# EAGLE design Pro_Micro_ISP (EAGLE 9.6.0)
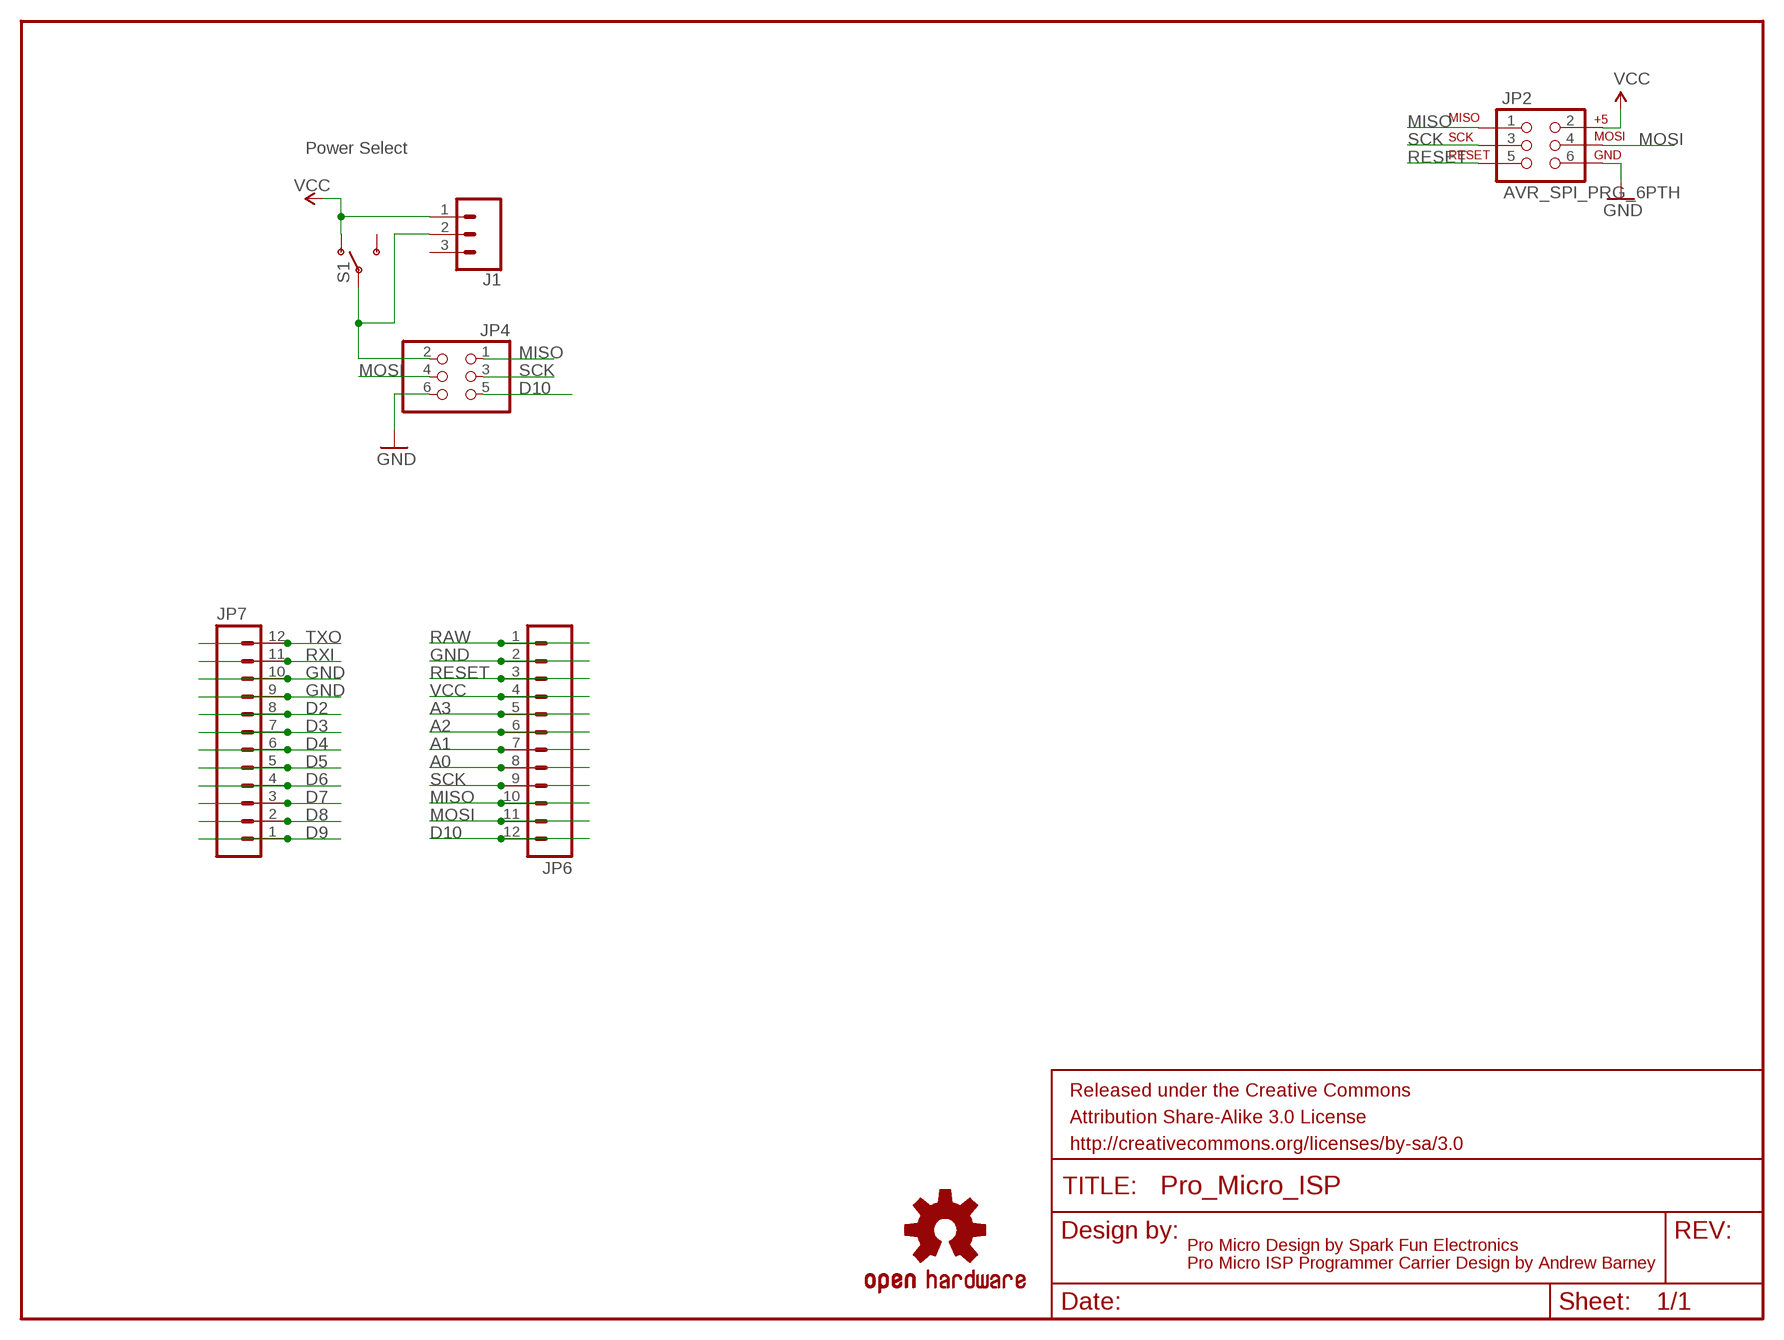
[diagram p0: schematic, sheet 1]

## Parts
FRAME1  FRAME-LETTER  [CREATIVE_COMMONS]
J1  CONN_03  [1X03]
JP2  AVR_SPI_PRG_6PTH  [2X3]
JP4  PINHD-2X3  [2X03]
JP6  M12PTH  [1X12]
JP7  M12PTH  [1X12]
S1  Power Select  SWITCH-SPSTSMD  [AYZ0202]
U$3  OSHW-LOGOS  [OSHW-LOGO-S]

## Nets
A0: JP6.8
A1: JP6.7
A2: JP6.6
A3: JP6.5
D2: JP7.8
D3: JP7.7
D4: JP7.6
D5: JP7.5
D6: JP7.4
D7: JP7.3
D8: JP7.2
D9: JP7.1
D10: JP4.5 JP6.12
GND [vcc]: JP2.6 JP4.6 JP6.2 JP7.9 JP7.10
MISO: JP2.1 JP4.1 JP6.10
MOSI: JP2.4 JP4.4 JP6.11
N$14: J1.2 JP4.2 S1.2(P)
RAW [vcc]: JP6.1
RESET: JP2.5 JP6.3
RXI: JP7.11
SCK: JP2.3 JP4.3 JP6.9
TXO: JP7.12
VCC: J1.1 JP2.2 JP6.4 S1.1(O)
Unconnected: J1.3 S1.3(S)

## Notes on the sheet
- Pro Micro Design by Spark Fun Electronics
- Pro Micro ISP Programmer Carrier Design by Andrew Barney

## Library data of the parts
FRAME1 = SparkFun-Aesthetics:FRAME-LETTER: Schematic Frame Standard 8.5x11 US Letter frame
J1 = SparkFun-Connectors:CONN_03: Multi connection point. Often used as Generic Header-pin footprint for 0.1 inch spaced/style header connections On any of the 0.1 inch spaced packages, you can populate with these: Break Away Headers - Straight <https://www.sparkfun.com/products/116> (PRT-00116) Break Away Male Headers - Right Angle <https://www.sparkfun.com/products/553> (PRT-00553) Female Headers <https://www.sparkfun.com/products/115> (PRT-00115) Break Away Headers - Machine Pin <https://www.sparkfun.com/products/117> (PRT-00117) Break Away Female Headers - Swiss Machine Pin <https://www.sparkfun.com/products/743> (PRT-00743) Stackable Header - 3 Pin (Female, 0.1") <https://www.sparkfun.com/products/13875> (PRT-13875) For SCREWTERMINALS and SPRING TERMINALS visit here: Screw Terimnals on SparkFun.com <https://www.sparkfun.com/search/results?term=Screw+Terminals> (5mm/3.5mm/2.54mm spacing) This device is also useful as a general connection point to wire up your design to another part of your project. Our various solder wires solder well into these plated through hole pads. Hook-Up Wire - Assortment (Stranded, 22 AWG) <https://www.sparkfun.com/products/11375> (PRT-11375) Hook-Up Wire - Assortment (Solid Core, 22 AWG) <https://www.sparkfun.com/products/11367> (PRT-11367) View the entire wire category on our website here <https://www.sparkfun.com/categories/141> Special notes: Molex polarized connector foot print use with SKU : PRT-08232 with associated crimp pins and housings.
JP2 = SparkFun:AVR_SPI_PRG_6: AVR ISP 6 Pin This is the reduced ISP connector for AVR programming. Common on Arduino. This footprint will take up less PCB space and can be used with a 10-pin to 6-pin adapter such as SKU: BOB-08508
JP4 = pinhead-ez:PINHD-2X3: PIN HEADER
JP6 JP7 = SparkFun:M12: Header 12 Standard 12-pin 0.1" header. Use with straight break away headers (SKU : PRT-00116), right angle break away headers (PRT-00553), swiss pins (PRT-00743), machine pins (PRT-00117), and female headers (PRT-00115).
S1 = SparkFun:SWITCH-SPST: SPST Switch Simple slide switch. Spark Fun Electronics SKU : COM-00102
U$3 = SparkFun:OSHW-LOGO: Open Source Hardware Logo This logo indicates the piece of hardware it is found on incorporates a OSHW license and/or adheres to the definition of open source hardware found here: http://freedomdefined.org/OSHW

## Net classes
0 default: width 0.203 mm

## Board
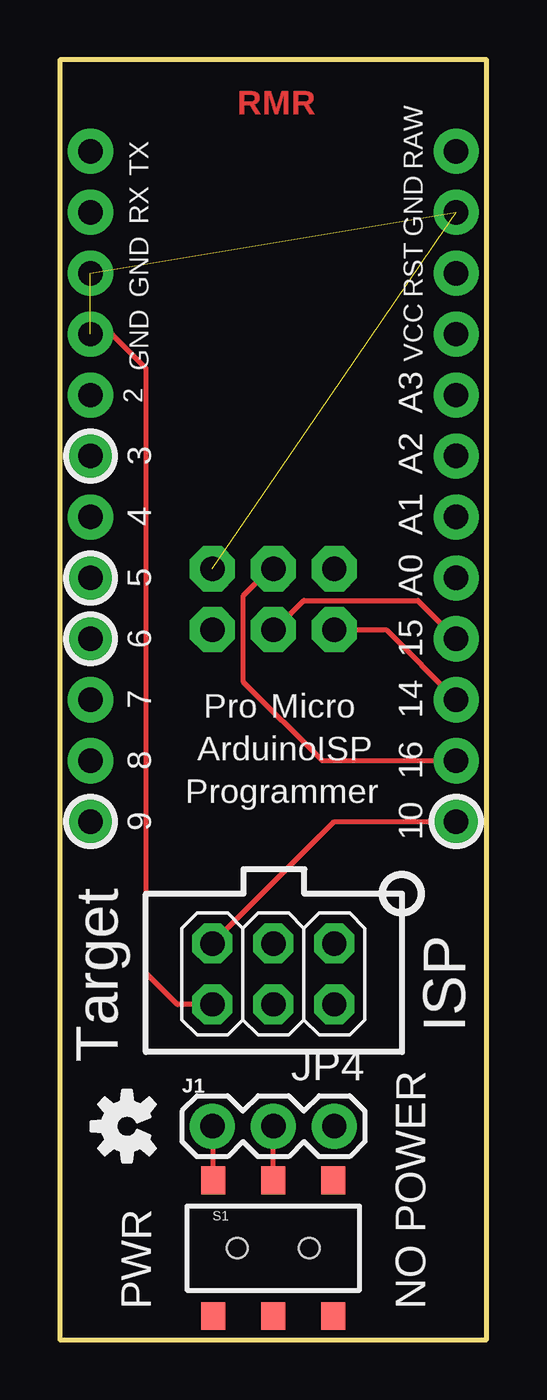
[diagram p1: board, top side]
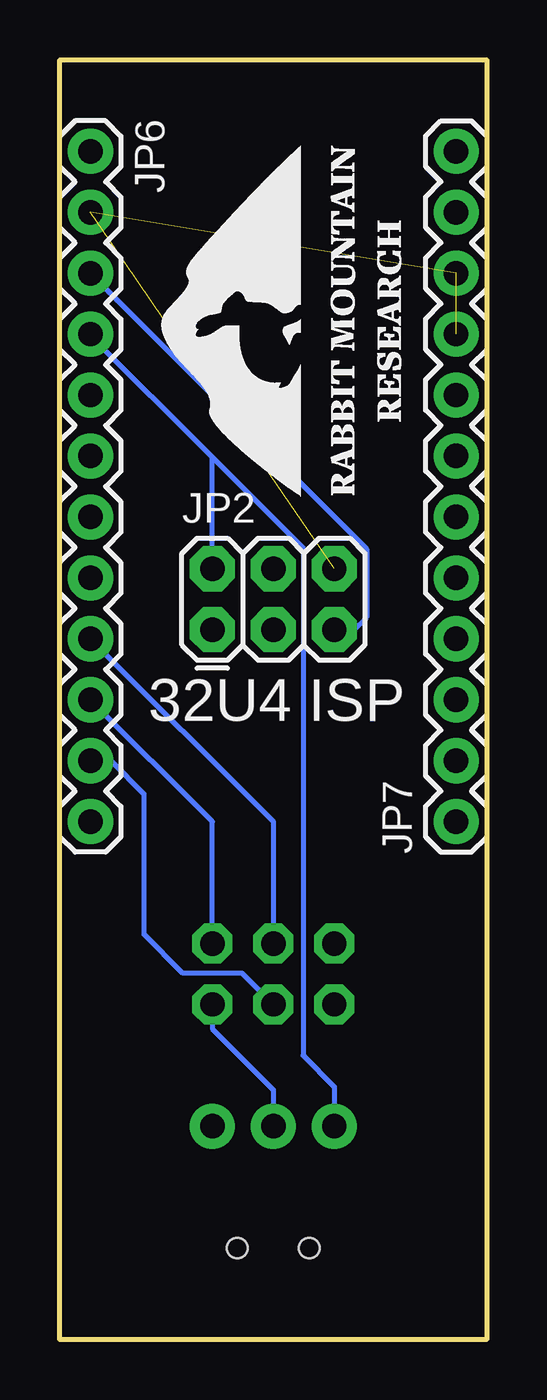
[diagram p2: board, bottom side, seen from below]

Size 17.78 x 53.34 mm. Coordinates in mm from the lower left corner, seen from the top.
Outline: 0,53.34 0,0 17.78,0 17.78,53.34 0,53.34
Copper layers (1*16): Top 0.035mm / dielectric 1.5mm / Bottom 0.035mm
Design rules "SparkFun *": minimum track width 8mil, minimum drill 15mil, track to track 7mil, track to pad 7mil, pad to pad 7mil, via to via 7mil, smd to smd 7mil, copper to edge 7mil, drill to drill 7mil, minimum pad ring 12mil, minimum via ring 10mil, stop-mask expansion 4mil, vias tented up to drill 20mil, thermal gap 10mil
tRestrict: area 9.1,29.9 to 9.3,30; area 13.1,33.9 to 13.1,34; area 5.5,30.6 to 12.6,37.9

### Footprints (pad centres in the part's own frame; a part is rotated, then mirrored left to right if it is on the bottom)
1X03 = drill 1.016 pad 1.88: 1 0,0; 2 2.54,0; 3 5.08,0
2X3 = drill 1.016 pad 1.88 octagon: 1 0,0; 2 0,2.54; 3 2.54,0; 4 2.54,2.54; 5 5.08,0; 6 5.08,2.54
2X03 = drill 1.016 pad 1.676 octagon: 1 -2.54,-1.27; 2 -2.54,1.27; 3 0,-1.27; 4 0,1.27; 5 2.54,-1.27; 6 2.54,1.27
1X12 = drill 1.016 pad 1.88: 1 0,0; 2 2.54,0; 3 5.08,0; 4 7.62,0; 5 10.16,0; 6 12.7,0; 7 15.24,0; 8 17.78,0; 9 20.32,0; 10 22.86,0; 11 25.4,0; 12 27.94,0
AYZ0202 = smd 1 x 1.15: 1 -2.5,2.825; 2 0,2.825; 3 2.5,2.825; 4 -2.5,-2.825; 5 0,-2.825; 6 2.5,-2.825 | hole 0.85: 1.5,0; -1.5,0

### Placement (x,y rotation side)
FRAME1  -9.63,58.42 0 top  (outside the outline)
J1  6.35,8.89 0 top
JP2  11.43,29.59 0 bottom
JP4  8.89,15.24 180 top
JP6  16.51,49.53 270 bottom
JP7  1.27,21.59 90 bottom
S1  8.89,3.81 0 top
U$1  [RMR-SIT-10MM]  3.56,35.18 90 bottom
U$3  2.79,8.89 90 top

### Tracks (layer width: path | path; a pad name or v marks a point on that pad's centre or on a via)
D10
  Top 0.203: JP4.5 11.43,21.59 JP6.12
GND  (3 unrouted)
  Top 0.203: JP4.6 4.9,13.97 3.58,15.29 3.58,40.49 2.16,41.91 JP7.9
MISO
  Top 0.203: JP2.1 13.59,29.59 JP6.10
  Bottom 0.203: JP4.1 11.43,21.59 JP6.10
MOSI
  Top 0.203: JP6.11 10.92,24.13 7.62,27.43 7.62,30.99 8.76,32.13 JP2.4
  Bottom 0.203: JP4.4 10.19,15.27 12.65,15.27 14.28,16.89 14.28,22.73 15.68,24.13 JP6.11
N$14
  Top 0.203: S1.2 J1.2
  Bottom 0.203: JP4.2 11.43,12.95 8.89,10.41 J1.2
RESET
  Bottom 0.203: JP2.5 5.51,29.59 5,30.1 5,32.94 JP6.3
SCK
  Top 0.203: JP2.3 8.94,29.59 10.16,30.81 14.91,30.81 JP6.9
  Bottom 0.203: JP4.3 8.89,21.59 JP6.9
VCC
  Top 0.203: S1.1 6.39,8.85 J1.1
  Bottom 0.203: 11.43,36.78 7.64,32.99 7.64,11.84 6.35,10.54 J1.1 | JP6.4 16.51,41.86 11.43,36.78 | JP2.2 11.43,36.78

### Text on the board
Top: RMR
tPlace: TX | RAW | RX | GND | GND | RST | GND | VCC | 2 | A3 | 3 | A2 | 4 | A1 | 5 | A0 | 6 | 15 | 7 | Pro | Micro | 14 | ArduinoISP | 8 | 16 | Programmer | 9 | 10 | ISP | Target | PWR | NO POWER
bPlace: 32U4 ISP
tValues: Valid combinations: | 3.3V Reg / 8MHz | 5V Reg / 16MHz | Mark back accordingly
tDocu: Andrew Barney